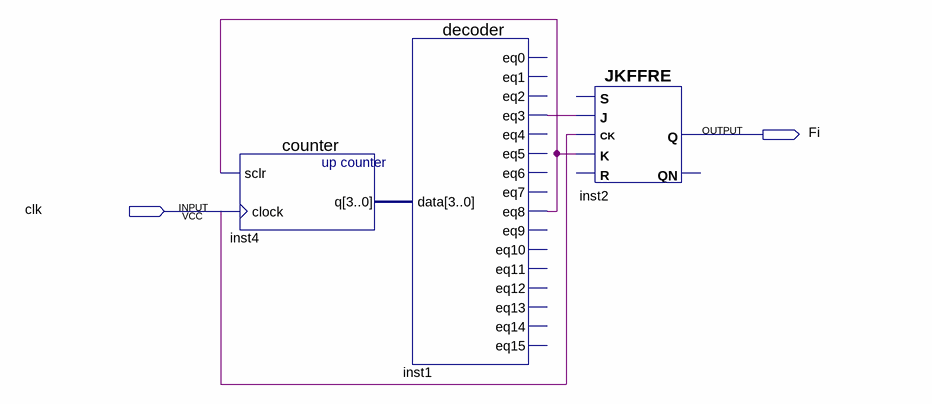
[diagram p0: schematic sheet]
// Quartus schematic Block1.bdf as structural Verilog: 3 symbols, 2 pins
module Block1 (
  input  clk,
  output Fi
);

  wire inst1_eq3, inst1_eq8;
  wire [3:0] inst4_q;

  counter inst4 (.sclr(inst1_eq8), .clock(clk), .q(inst4_q));
  decoder inst1 (
    .data(inst4_q), .eq3(inst1_eq3), .eq8(inst1_eq8));  // open: eq0, eq1, eq2, eq4, eq5, eq6, eq7, eq9, eq10, eq11, eq12, eq13, eq14, eq15
  JKFFRE inst2 (.K(inst1_eq8), .CK(clk), .J(inst1_eq3), .Q(Fi));  // open: R, S, QN
endmodule
